# EAGLE design XT-08_Attenuators (EAGLE 9.5.1)
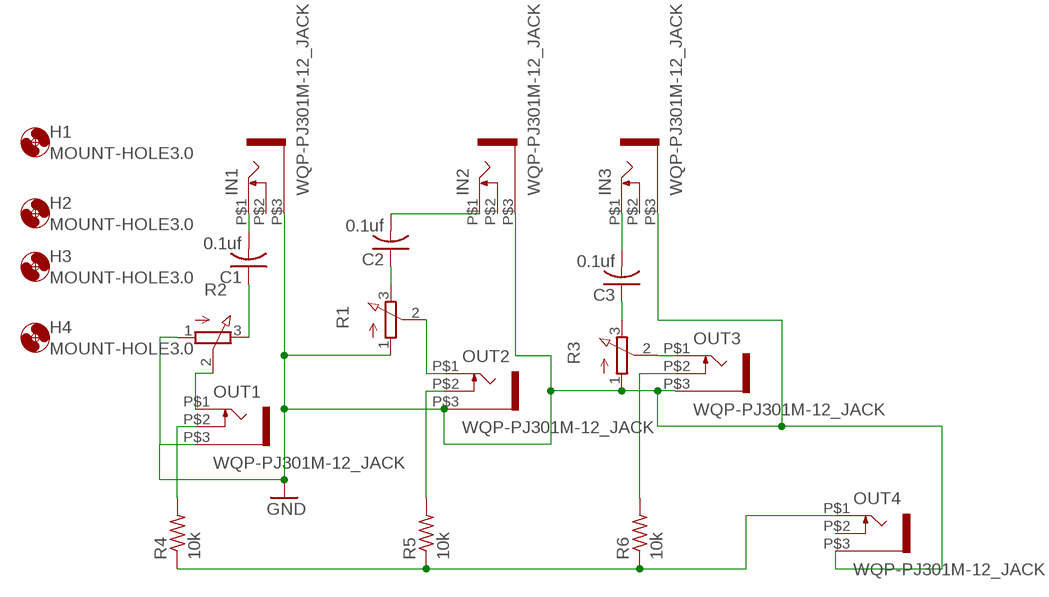
[diagram p0: schematic, sheet 1]

## Parts
C1  0.1uf  C-US050-025X075  [C050-025X075]
C2  0.1uf  C-US050-025X075  [C050-025X075]
C3  0.1uf  C-US050-025X075  [C050-025X075]
H1  MOUNT-HOLE3.0  [3,0]
H2  MOUNT-HOLE3.0  [3,0]
H3  MOUNT-HOLE3.0  [3,0]
H4  MOUNT-HOLE3.0  [3,0]
IN1  WQP-PJ301M-12_JACK  [WQP-PJ301M-12_JACK]
IN2  WQP-PJ301M-12_JACK  [WQP-PJ301M-12_JACK]
IN3  WQP-PJ301M-12_JACK  [WQP-PJ301M-12_JACK]
OUT1  WQP-PJ301M-12_JACK  [WQP-PJ301M-12_JACK]
OUT2  WQP-PJ301M-12_JACK  [WQP-PJ301M-12_JACK]
OUT3  WQP-PJ301M-12_JACK  [WQP-PJ301M-12_JACK]
OUT4  WQP-PJ301M-12_JACK  [WQP-PJ301M-12_JACK]
R1  EVUF2L  [EVUFXL]
R2  EVUF2L  [EVUFXL]
R3  EVUF2L  [EVUFXL]
R4  10k  R-US_0204/7  [0204/7]
R5  10k  R-US_0204/7  [0204/7]
R6  10k  R-US_0204/7  [0204/7]

## Nets
GND: IN1.P$3 IN2.P$3 IN3.P$3 OUT1.P$3 OUT2.P$3 OUT3.P$3 OUT4.P$3 R1.1(A) R2.1(A) R3.1(A)
N$1: C1.2 IN1.P$1
N$2: C2.1 R1.3(E)
N$3: OUT2.P$1 R1.2(S)
N$4: C2.2 IN2.P$1
N$5: C1.1 R2.3(E)
N$6: OUT1.P$1 R2.2(S)
N$7: C3.2 IN3.P$1
N$8: C3.1 R3.3(E)
N$9: OUT3.P$1 R3.2(S)
N$10: OUT1.P$2 R4.2
N$11: OUT2.P$2 R5.2
N$12: OUT3.P$2 R6.2
N$13: OUT4.P$1 R4.1 R5.1 R6.1
Unconnected: IN1.P$2 IN2.P$2 IN3.P$2 OUT4.P$2

## Library data of the parts
C1-C3 = rcl:C-US: CAPACITOR, American symbol; SPICEPREFIX: C
H1-H4 = holes:MOUNT-HOLE: MOUNTING HOLE with drill center marker
IN1-IN3 OUT1-OUT4 = thonkiconn:WQP-PJ301M-12_JACK
R1-R3 = pot:EVU: 9 mm Square Rotary Potentiometers Source: Panasonic
R4-R6 = rcl:R-US_: RESISTOR, American symbol; SPICEPREFIX: R

## Board
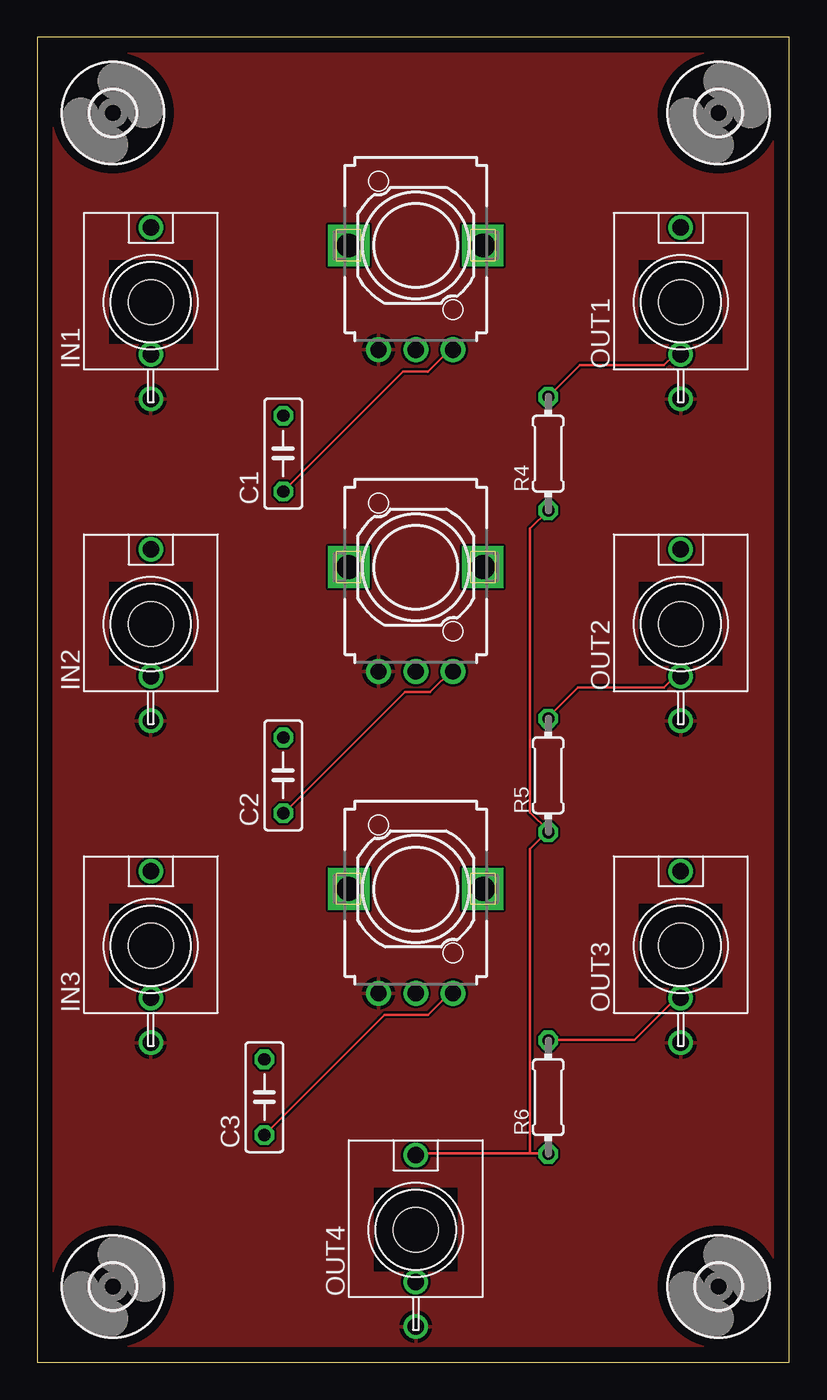
[diagram p1: board, top side]
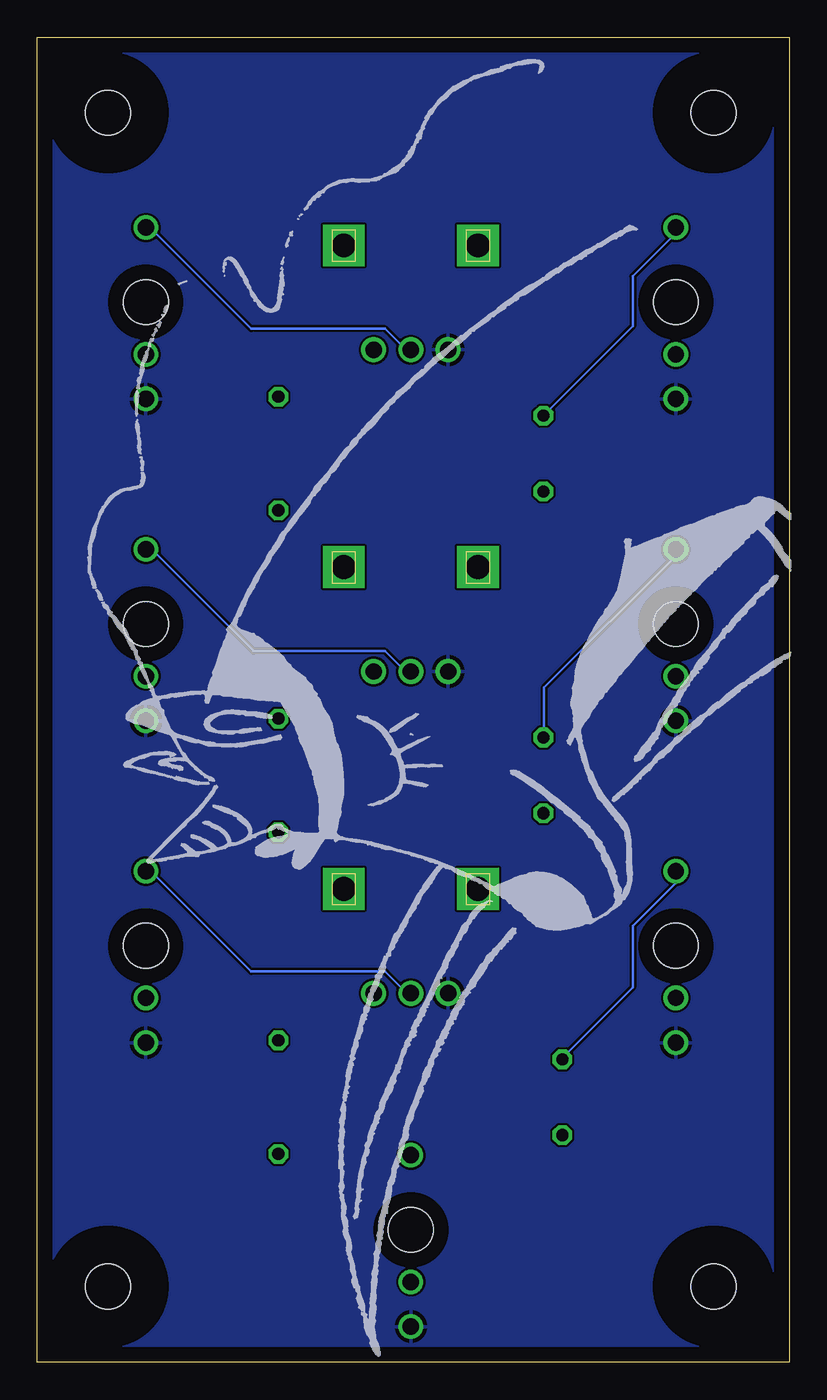
[diagram p2: board, bottom side, seen from below]

Size 50.47 x 88.89 mm. Coordinates in mm from the lower left corner, seen from the top.
Outline: 0,0 50.47,0 50.47,88.89 0,88.89 0,0
Copper layers (1*16): Top 0.035mm / dielectric 1.5mm / Bottom 0.035mm
Design rules "default": minimum track width 6mil, minimum drill 0.35mm, track to track 6mil, track to pad 6mil, pad to pad 6mil, via to via 6mil, smd to smd 6mil, copper to edge 40mil, drill to drill 6mil, minimum pad ring 10mil, minimum via ring 8mil, stop-mask expansion 4mil, vias tented up to drill 0mil, thermal gap 10mil
Holes 3 mm at 7.62,71.12 43.18,71.12 43.18,49.53 7.62,49.53 7.62,27.94 43.18,27.94 25.4,8.89

### Footprints (pad centres in the part's own frame; a part is rotated, then mirrored left to right if it is on the bottom)
C050-025X075 = drill 0.813 octagon: 1 -2.54,0; 2 2.54,0
3,0 = hole 3: 0,0
WQP-PJ301M-12_JACK = drill 1.1: P$1 0,5; P$2 0,-3.5; P$3 0,-6.5
EVUFXL = drill 1.1 pad 1.676: 1 -2.5,-7; 2 0,-7; 3 2.5,-7 | drill 1.6 pad 2.8 square: M1 4.5,0; M2 -4.5,0
0204/7 = drill 0.813 octagon: 1 -3.81,0; 2 3.81,0

### Placement (x,y rotation side)
C1  16.51,60.96 90 top
C2  16.51,39.37 90 top
C3  15.24,17.78 90 top
H1  45.72,83.82 0 top
H2  5.08,5.08 0 top
H3  45.72,5.08 0 top
H4  5.08,83.82 0 top
IN1  7.62,71.12 0 top
IN2  7.62,49.53 0 top
IN3  7.62,27.94 0 top
OUT1  43.18,71.12 0 top
OUT2  43.18,49.53 0 top
OUT3  43.18,27.94 0 top
OUT4  25.4,8.89 0 top
R1  25.4,53.34 0 top
R2  25.4,74.93 0 top
R3  25.4,31.75 0 top
R4  34.29,60.96 90 top
R5  34.29,39.37 90 top
R6  34.29,17.78 90 top

### Tracks (layer width: path | path; a pad name or v marks a point on that pad's centre or on a via)
GND
  pour Top (rank 3): 0,88.9 50.8,88.9 50.8,0 0,0
  pour Bottom (rank 3): 0,88.9 50.8,88.9 50.8,0 0,0
N$1
  Bottom 0.152: C1.2 10.52,69.49 10.52,72.85 7.62,75.74 IN1.P$1
N$2
  Top 0.152: C2.1 16.61,36.88 24.69,44.96 26.36,44.96 27.89,46.48 R1.3
N$3
  Bottom 0.152: OUT2.P$1 43.13,54.41 42.67,54.41 35.97,47.7 27.13,47.7 25.91,46.48 25.45,46.48 R1.2
N$4
  Bottom 0.152: IN2.P$1 7.62,54.1 16.46,45.26 16.46,41.91 C2.2
N$5
  Top 0.152: C1.1 24.54,66.45 26.21,66.45 27.58,67.82 27.89,67.82 R2.3
N$6
  Bottom 0.152: OUT1.P$1 43.13,76.05 42.82,76.05 36.12,69.34 27.13,69.34 25.76,67.97 25.45,67.97 R2.2
N$7
  Bottom 0.152: IN3.P$1 7.62,32.16 10.52,29.26 10.52,25.15 15.24,20.42 C3.2
N$8
  Top 0.152: C3.1 23.32,23.32 26.21,23.32 27.58,24.69 27.89,24.69 R3.3
N$9
  Bottom 0.152: OUT3.P$1 43.13,32.92 42.82,32.92 36.12,26.21 27.13,26.21 25.76,24.84 25.45,24.84 R3.2
N$10
  Top 0.152: R4.2 36.42,66.9 42.06,66.9 42.67,67.51 43.13,67.51 OUT1.P$2
N$11
  Top 0.152: R5.2 34.29,43.28 36.27,45.26 42.06,45.26 42.82,46.02 43.13,46.02 OUT2.P$2
N$12
  Top 0.152: R6.2 34.29,21.64 40.08,21.64 42.82,24.38 43.13,24.38 OUT3.P$2
N$13
  Top 0.152: 33.07,14.02 25.45,14.02 OUT4.P$1 | 33.07,14.02 34.29,14.02 R6.1 | 34.29,35.66 33.07,36.88 33.07,55.93 R4.1 | 33.07,14.02 33.07,34.44 34.29,35.66 | 34.29,35.66 R5.1

### Text on the board
tValues: VauxFlores | XT-08 Attenuators